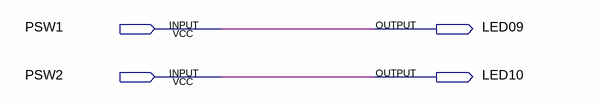
[diagram p0: schematic sheet]
// Quartus schematic psw_test.bdf as structural Verilog: 0 symbols, 4 pins
module psw_test (
  input  PSW1,
  input  PSW2,
  output LED09,
  output LED10
);


  assign LED09 = PSW1;
  assign LED10 = PSW2;
endmodule
